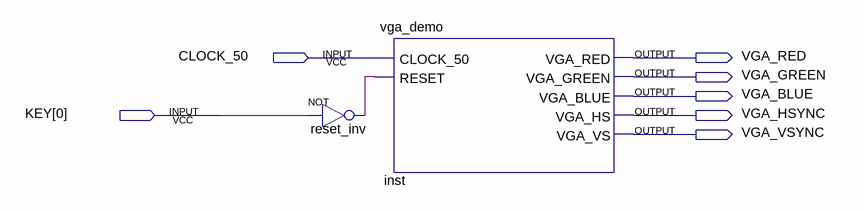
[diagram p0: schematic sheet]
// Quartus schematic vga.bdf as structural Verilog: 2 symbols, 7 pins
module vga (
  input  CLOCK_50,
  input  [0:0] KEY,
  output VGA_RED,
  output VGA_GREEN,
  output VGA_BLUE,
  output VGA_HSYNC,
  output VGA_VSYNC
);

  wire reset_inv_out;

  not reset_inv (reset_inv_out, KEY[0]);
  vga_demo inst (
    .CLOCK_50(CLOCK_50), .RESET(reset_inv_out), .VGA_RED(VGA_RED), .VGA_GREEN(VGA_GREEN),
    .VGA_BLUE(VGA_BLUE), .VGA_HS(VGA_HSYNC), .VGA_VS(VGA_VSYNC));
endmodule
